# Altium project BugBuster.PrjPcb (part 3 of 4)

## Sheet Analog.SchDoc
size A3; SheetNumber: 4; SheetTotal: 5
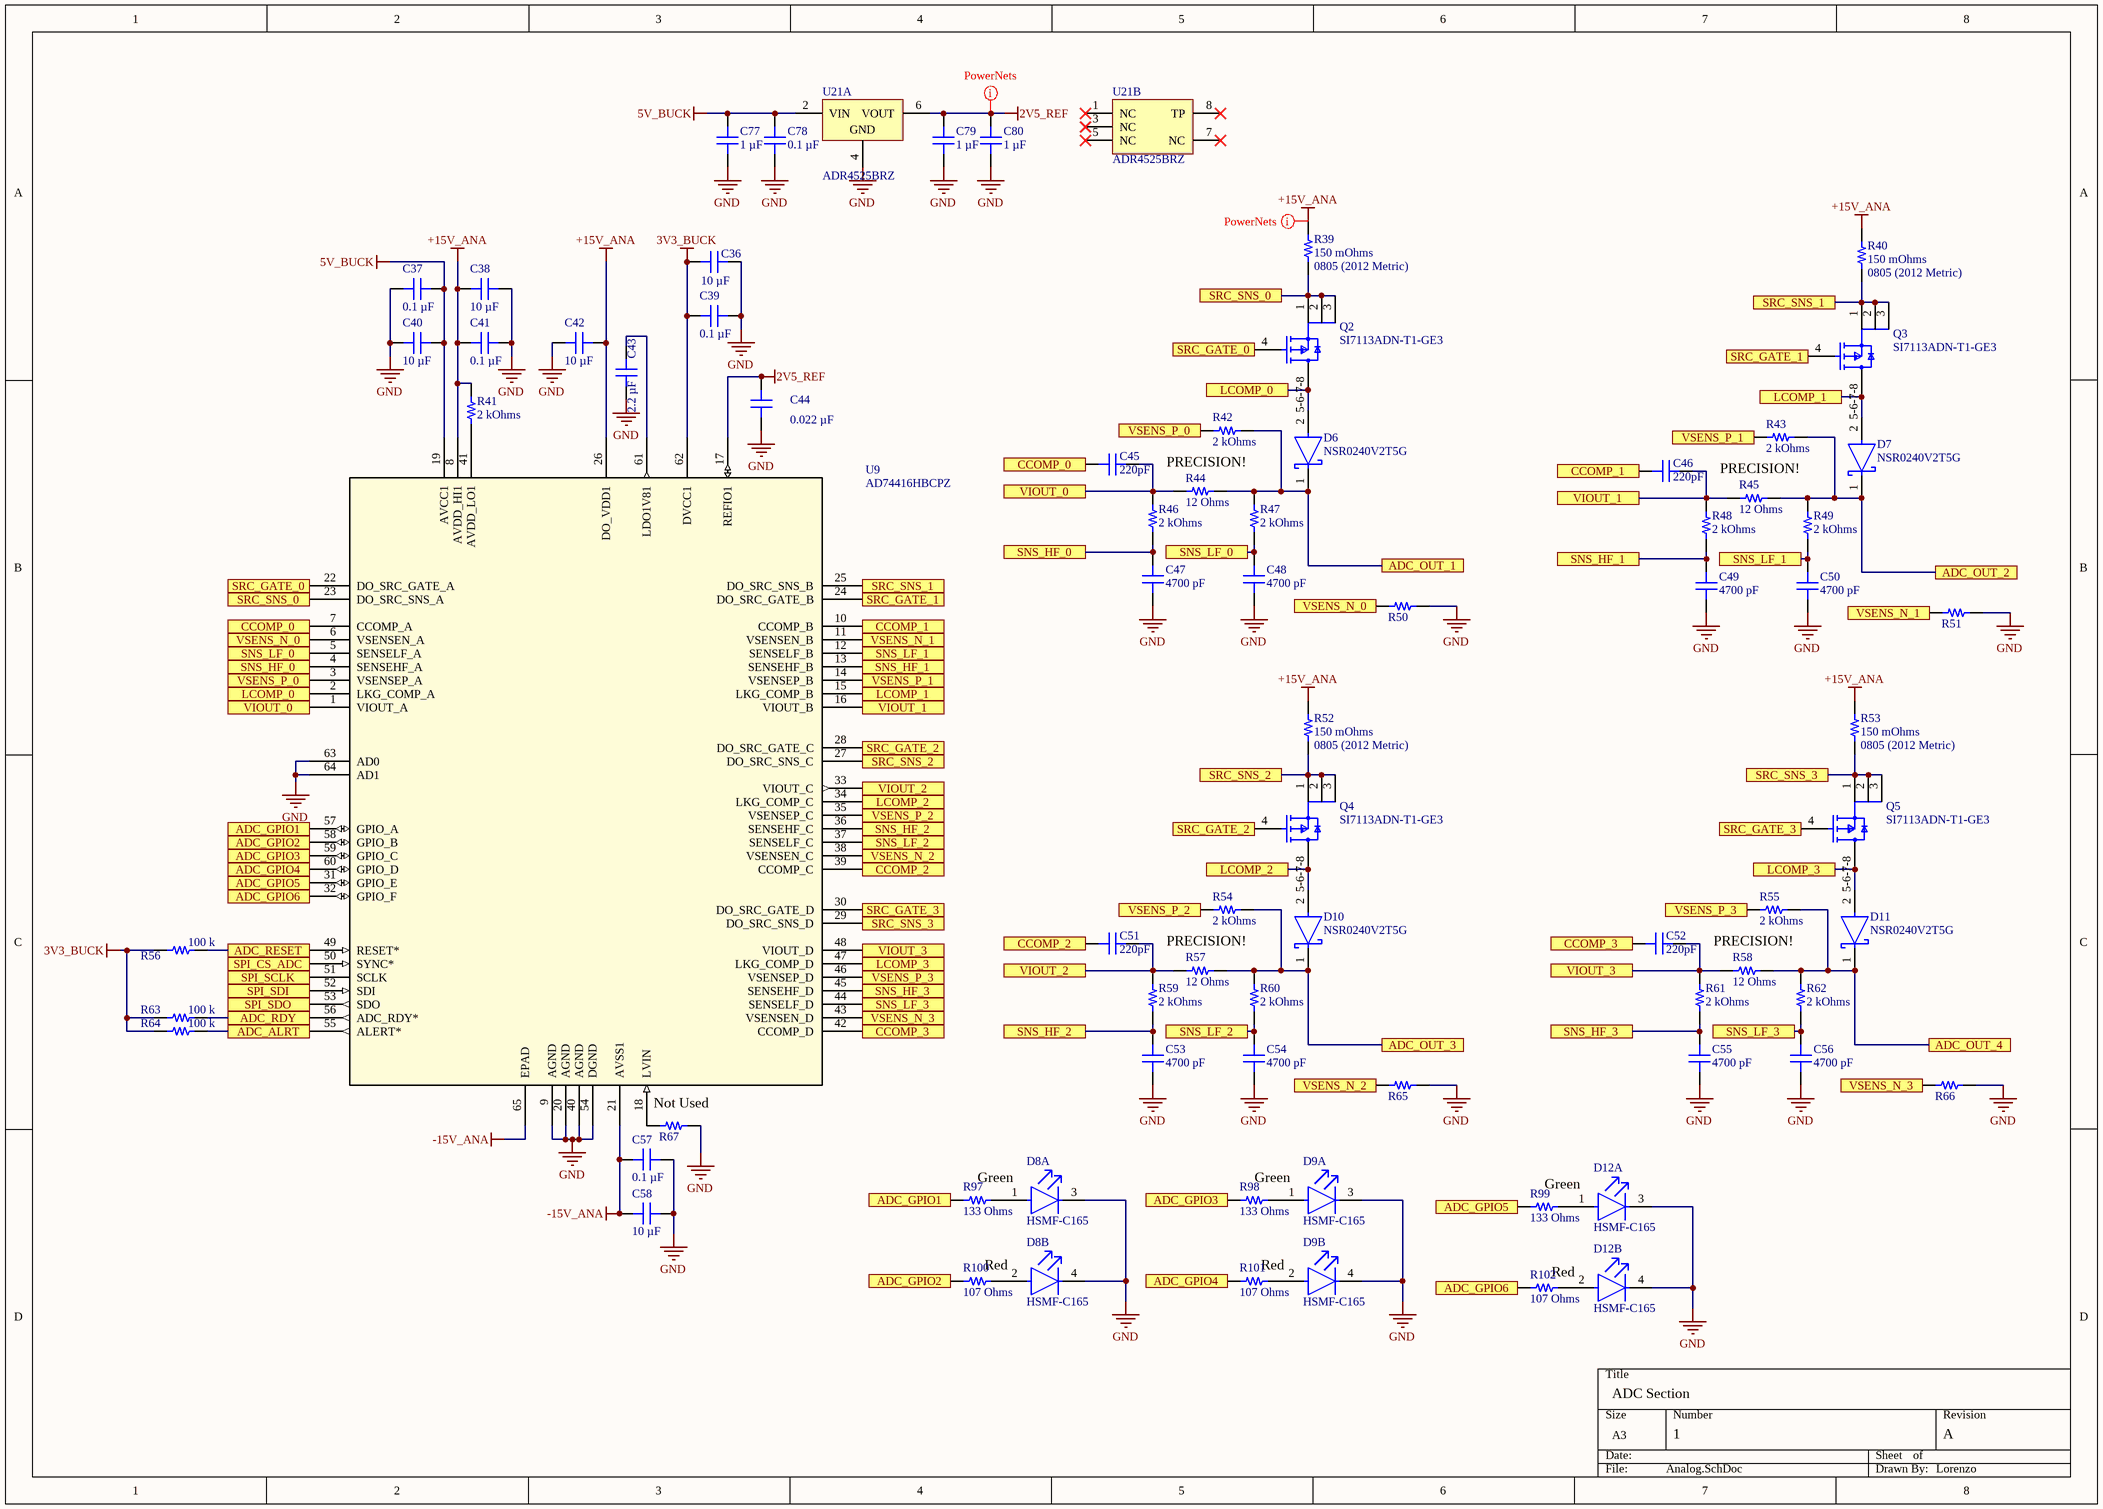
[diagram p3: Analog.SchDoc]

### Parts
C36  10 µF  [CAP 0603_1608]
C37  0.1 µF  [CAP 0603_1608]
C38  10 µF  [CAP 0603_1608]
C39  0.1 µF  [CAP 0603_1608]
C40  10 µF  [CAP 0603_1608]
C41  0.1 µF  [CAP 0603_1608]
C42  10 µF  [CAP 0603_1608]
C43  2.2 µF  [CAP 0603_1608]
C44  0.022 µF  [CAP 0603_1608]
C45  220pF  [CAP 0603_1608]
C46  220pF  [CAP 0603_1608]
C47  4700 pF  [CAP 0603_1608]
C48  4700 pF  [CAP 0603_1608]
C49  4700 pF  [CAP 0603_1608]
C50  4700 pF  [CAP 0603_1608]
C51  220pF  [CAP 0603_1608]
C52  220pF  [CAP 0603_1608]
C53  4700 pF  [CAP 0603_1608]
C54  4700 pF  [CAP 0603_1608]
C55  4700 pF  [CAP 0603_1608]
C56  4700 pF  [CAP 0603_1608]
C57  0.1 µF  [CAP 0603_1608]
C58  10 µF  [CAP 0603_1608]
C77  1 µF  [CAP 0603_1608]
C78  0.1 µF  [CAP 0603_1608]
C79  1 µF  [CAP 0603_1608]
C80  1 µF  [CAP 0603_1608]
D6  NSR0240V2T5G  [FP-502-MFG]
D7  NSR0240V2T5G  [FP-502-MFG]
D8  HSMF-C165  [FP-HSMF-C165-MFG]  (parts A,B of 2)
D9  HSMF-C165  [FP-HSMF-C165-MFG]  (parts A,B of 2)
D10  NSR0240V2T5G  [FP-502-MFG]
D11  NSR0240V2T5G  [FP-502-MFG]
D12  HSMF-C165  [FP-HSMF-C165-MFG]  (parts A,B of 2)
Q2  SI7113ADN-T1-GE3  [FP-S16-2667-SINGLE-MFG]
Q3  SI7113ADN-T1-GE3  [FP-S16-2667-SINGLE-MFG]
Q4  SI7113ADN-T1-GE3  [FP-S16-2667-SINGLE-MFG]
Q5  SI7113ADN-T1-GE3  [FP-S16-2667-SINGLE-MFG]
R39  150 mOhms  Package / Case: 0805 (2012 Metric)  [STACKPOLE CSR0805]
R40  150 mOhms  Package / Case: 0805 (2012 Metric)  [STACKPOLE CSR0805]
R41  2 kOhms  [RES 0603_1608]
R42  2 kOhms  [RES 0603_1608]
R43  2 kOhms  [RES 0603_1608]
R44  12 Ohms  [RES 0603_1608]
R45  12 Ohms  [RES 0603_1608]
R46  2 kOhms  [RES 0603_1608]
R47  2 kOhms  [RES 0603_1608]
R48  2 kOhms  [RES 0603_1608]
R49  2 kOhms  [RES 0603_1608]
R50  (no value)  [RES 0603_1608]
R51  (no value)  [RES 0603_1608]
R52  150 mOhms  Package / Case: 0805 (2012 Metric)  [STACKPOLE CSR0805]
R53  150 mOhms  Package / Case: 0805 (2012 Metric)  [STACKPOLE CSR0805]
R54  2 kOhms  [RES 0603_1608]
R55  2 kOhms  [RES 0603_1608]
R56  100 k  [RES 0603_1608]
R57  12 Ohms  [RES 0603_1608]
R58  12 Ohms  [RES 0603_1608]
R59  2 kOhms  [RES 0603_1608]
R60  2 kOhms  [RES 0603_1608]
R61  2 kOhms  [RES 0603_1608]
R62  2 kOhms  [RES 0603_1608]
R63  100 k  [RES 0603_1608]
R64  100 k  [RES 0603_1608]
R65  (no value)  [RES 0603_1608]
R66  (no value)  [RES 0603_1608]
R67  (no value)  [RES 0603_1608]
R97  133 Ohms  [RES 0603_1608]
R98  133 Ohms  [RES 0603_1608]
R99  133 Ohms  [RES 0603_1608]
R100  107 Ohms  [RES 0603_1608]
R101  107 Ohms  [RES 0603_1608]
R102  107 Ohms  [RES 0603_1608]
U9  AD74416HBCPZ  [CP-64-15_ADI]
U21  ADR4525BRZ  [ADI-R-8_N]  (parts A,B of 2)

### Ports
ADC_ALRT, ADC_GPIO1, ADC_GPIO2, ADC_GPIO3, ADC_GPIO4, ADC_GPIO5, ADC_GPIO6, ADC_OUT_1, ADC_OUT_2, ADC_OUT_3, ADC_OUT_4, ADC_RDY, ADC_RESET, CCOMP_0, CCOMP_1, CCOMP_2, CCOMP_3, LCOMP_0, LCOMP_1, LCOMP_2, LCOMP_3, SNS_HF_0, SNS_HF_1, SNS_HF_2, SNS_HF_3, SNS_LF_0, SNS_LF_1, SNS_LF_2, SNS_LF_3, SPI_CS_ADC, SPI_SCLK, SPI_SDI, SPI_SDO, SRC_GATE_0, SRC_GATE_1, SRC_GATE_2, SRC_GATE_3, SRC_SNS_0, SRC_SNS_1, SRC_SNS_2, SRC_SNS_3, VIOUT_0, VIOUT_1, VIOUT_2, VIOUT_3, VSENS_N_0, VSENS_N_1, VSENS_N_2, VSENS_N_3, VSENS_P_0, VSENS_P_1, VSENS_P_2, VSENS_P_3

### Nets
2V5_REF: C44.2 C79.2 C80.2 U9.17(REFIO1) U21.6(VOUT)
3V3_BUCK: C36.1 C39.1 R56.1 R63.1 R64.1 U9.62(DVCC1)
5V_BUCK: C37.1 C40.1 C77.2 C78.2 U9.19(AVCC1) U21.2(VIN)
+15V_ANA: C38.1 C41.1 C42.2 R39.2 R40.2 R41.2 R52.2 R53.2 U9.8(AVDD_HI1) U9.26(DO_VDD1)
-15V_ANA: C57.2 C58.2 U9.21(AVSS1) U9.65(EPAD)
GND: C36.2 C37.2 C38.2 C39.2 C40.2 C41.2 C42.1 C43.2 C44.1 C47.2 C48.2 C49.2 C50.2 C53.2 C54.2 C55.2 C56.2 C57.1 C58.1 C77.1 C78.1 C79.1 C80.1 D8.3(GREEN_C) D8.4(RED_C) D9.3(GREEN_C) D9.4(RED_C) D12.3(GREEN_C) D12.4(RED_C) R50.2 R51.2 R65.2 R66.2 R67.2 U9.9(AGND) U9.20(AGND) U9.40(AGND) U9.54(DGND) U9.63(AD0) U9.64(AD1) U21.4(GND)
NetC43_1: C43.1 U9.61(LDO1V81)
NetC45_1: C45.1 U9.7(CCOMP_A) ; port CCOMP_0
NetC45_2: C45.2 R44.1 R46.2 U9.1(VIOUT_A) ; port VIOUT_0
NetC46_1: C46.1 U9.10(CCOMP_B) ; port CCOMP_1
NetC46_2: C46.2 R45.1 R48.2 U9.16(VIOUT_B) ; port VIOUT_1
NetC47_1: C47.1 R46.1 U9.4(SENSEHF_A) ; port SNS_HF_0
NetC48_1: C48.1 R47.1 U9.5(SENSELF_A) ; port SNS_LF_0
NetC49_1: C49.1 R48.1 U9.13(SENSEHF_B) ; port SNS_HF_1
NetC50_1: C50.1 R49.1 U9.12(SENSELF_B) ; port SNS_LF_1
NetC51_1: C51.1 U9.39(CCOMP_C) ; port CCOMP_2
NetC51_2: C51.2 R57.1 R59.2 U9.33(VIOUT_C) ; port VIOUT_2
NetC52_1: C52.1 U9.42(CCOMP_D) ; port CCOMP_3
NetC52_2: C52.2 R58.1 R61.2 U9.48(VIOUT_D) ; port VIOUT_3
NetC53_1: C53.1 R59.1 U9.36(SENSEHF_C) ; port SNS_HF_2
NetC54_1: C54.1 R60.1 U9.37(SENSELF_C) ; port SNS_LF_2
NetC55_1: C55.1 R61.1 U9.45(SENSEHF_D) ; port SNS_HF_3
NetC56_1: C56.1 R62.1 U9.44(SENSELF_D) ; port SNS_LF_3
NetD6_1: D6.1(C) R42.2 R44.2 R47.2 ; port ADC_OUT_1
NetD6_2: D6.2(A) Q2.5-6-7-8(D) U9.2(LKG_COMP_A) ; port LCOMP_0
NetD7_1: D7.1(C) R43.2 R45.2 R49.2 ; port ADC_OUT_2
NetD7_2: D7.2(A) Q3.5-6-7-8(D) U9.15(LKG_COMP_B) ; port LCOMP_1
NetD8_1: D8.1(GREEN_A) R97.2
NetD8_2: D8.2(RED_A) R100.2
NetD9_1: D9.1(GREEN_A) R98.2
NetD9_2: D9.2(RED_A) R101.2
NetD10_1: D10.1(C) R54.2 R57.2 R60.2 ; port ADC_OUT_3
NetD10_2: D10.2(A) Q4.5-6-7-8(D) U9.34(LKG_COMP_C) ; port LCOMP_2
NetD11_1: D11.1(C) R55.2 R58.2 R62.2 ; port ADC_OUT_4
NetD11_2: D11.2(A) Q5.5-6-7-8(D) U9.47(LKG_COMP_D) ; port LCOMP_3
NetD12_1: D12.1(GREEN_A) R99.2
NetD12_2: D12.2(RED_A) R102.2
NetQ2_1: Q2.1(S) Q2.2(S) Q2.3(S) R39.1 U9.23(DO_SRC_SNS_A) ; port SRC_SNS_0
NetQ2_4: Q2.4(G) U9.22(DO_SRC_GATE_A) ; port SRC_GATE_0
NetQ3_1: Q3.1(S) Q3.2(S) Q3.3(S) R40.1 U9.25(DO_SRC_SNS_B) ; port SRC_SNS_1
NetQ3_4: Q3.4(G) U9.24(DO_SRC_GATE_B) ; port SRC_GATE_1
NetQ4_1: Q4.1(S) Q4.2(S) Q4.3(S) R52.1 U9.27(DO_SRC_SNS_C) ; port SRC_SNS_2
NetQ4_4: Q4.4(G) U9.28(DO_SRC_GATE_C) ; port SRC_GATE_2
NetQ5_1: Q5.1(S) Q5.2(S) Q5.3(S) R53.1 U9.29(DO_SRC_SNS_D) ; port SRC_SNS_3
NetQ5_4: Q5.4(G) U9.30(DO_SRC_GATE_D) ; port SRC_GATE_3
NetR41_1: R41.1 U9.41(AVDD_LO1)
NetR42_1: R42.1 U9.3(VSENSEP_A) ; port VSENS_P_0
NetR43_1: R43.1 U9.14(VSENSEP_B) ; port VSENS_P_1
NetR50_1: R50.1 U9.6(VSENSEN_A) ; port VSENS_N_0
NetR51_1: R51.1 U9.11(VSENSEN_B) ; port VSENS_N_1
NetR54_1: R54.1 U9.35(VSENSEP_C) ; port VSENS_P_2
NetR55_1: R55.1 U9.46(VSENSEP_D) ; port VSENS_P_3
NetR56_2: R56.2 U9.49(RESET*) ; port ADC_RESET
NetR63_2: R63.2 U9.56(ADC_RDY*) ; port ADC_RDY
NetR64_2: R64.2 U9.55(ALERT*) ; port ADC_ALRT
NetR65_1: R65.1 U9.38(VSENSEN_C) ; port VSENS_N_2
NetR66_1: R66.1 U9.43(VSENSEN_D) ; port VSENS_N_3
NetR67_1: R67.1 U9.18(LVIN)
NetR97_1: R97.1 U9.57(GPIO_A) ; port ADC_GPIO1
NetR98_1: R98.1 U9.59(GPIO_C) ; port ADC_GPIO3
NetR99_1: R99.1 U9.31(GPIO_E) ; port ADC_GPIO5
NetR100_1: R100.1 U9.58(GPIO_B) ; port ADC_GPIO2
NetR101_1: R101.1 U9.60(GPIO_D) ; port ADC_GPIO4
NetR102_1: R102.1 U9.32(GPIO_F) ; port ADC_GPIO6
NetU1_9: U9.51(SCLK) ; port SPI_SCLK
NetU1_10: U9.52(SDI) ; port SPI_SDI
NetU1_11: U9.53(SDO) ; port SPI_SDO
NetU1_33: U9.50(SYNC*) ; port SPI_CS_ADC

Not connected (* = marked no-connect by the designer): U21 1(NC)* 3(NC)* 5(NC)* 7(NC)* 8(TP)*

### Layout directives
net class PowerNets: 2V5_REF, +15V_ANA

### Notes on the sheet
- PRECISION!
- Not Used
- Green
- (near R100) Red
- (near R101) Red
- (near R102) Red
- ADC Section
- 1
- A
- Lorenzo

### Library data of the parts
C36 C38 C40 C42 C58 = KGM15CS61E106MT: CAP CER 10UF 25V X6S 0603; manufacturer: KYOCERA AVX; Tolerance: ±20%; Part Number: KGM15CS61E106MT; Value: 10 µF; Applications: General Purpose; Capacitance: 10 µF; componentlink1description: Datasheet; componentlink1url: https://datasheets.kyocera-avx.com/x6s-dielectric.pdf; componentlink2description: DigiKey Link; componentlink2url: https://www.digikey.com/en/products/detail/kyocera-avx/KGM15CS61E106MT/16602925; Device Package: 0603 (1608 Metric); lastupdated: 09/02/2024 20:09:18; Lifecycle Status: Active; Minimum Order: 1; Mounting Type: Surface Mount, MLCC; Operating Temperature: -55°C ~ 105°C; Package / Case: 0603 (1608 Metric); packaging: TapeAndReel; partid: 52144; Part Status: Active; price: 0.06; series: KGM - X6S; Size / Dimension: 0.063" L x 0.031" W (1.60mm x 0.80mm); Supplier 1: DigiKey; Supplier Part Number 1: 478-KGM15CS61E106MTCT-ND; Temperature Coefficient: X6S; Thickness (Max): 0.039" (1.00mm); Voltage - Rated: 25V
C37 C39 C41 C57 C78 = KAM15AR71H104JT: CAP CER 0.1UF 50V X7R 0603; manufacturer: KYOCERA AVX; Tolerance: ±5%; Part Number: KAM15AR71H104JT; Value: 0.1 µF; Applications: Automotive; Capacitance: 0.1 µF; componentlink1description: Datasheet; componentlink1url: https://datasheets.kyocera-avx.com/AutoMLCC.pdf; componentlink2description: DigiKey Link; componentlink2url: https://www.digikey.com/en/products/detail/kyocera-avx/KAM15AR71H104JT/3080614; Device Package: 0603 (1608 Metric); lastupdated: 09/02/2024 20:09:10; Lifecycle Status: Active; Minimum Order: 1; Mounting Type: Surface Mount, MLCC; Operating Temperature: -55°C ~ 125°C; Package / Case: 0603 (1608 Metric); packaging: TapeAndReel; partid: 54247; Part Status: Active; price: 0.10; Ratings: AEC-Q200; series: -; Size / Dimension: 0.063" L x 0.032" W (1.60mm x 0.81mm); Supplier 1: DigiKey; Supplier Part Number 1: 478-KAM15AR71H104JTCT-ND; Temperature Coefficient: X7R; Thickness (Max): 0.035" (0.90mm); Voltage - Rated: 50V
C43 = GRM188Z71E225KE43D: CAP CER 2.2UF 25V X7R 0603; manufacturer: Murata Electronics; Tolerance: ±10%; Part Number: GRM188Z71E225KE43D; Value: 2.2 µF; Applications: General Purpose; Capacitance: 2.2 µF; componentlink1description: Datasheet; componentlink1url: https://search.murata.co.jp/Ceramy/image/img/A01X/G101/ENG/GRM188Z71E225KE43-01A.pdf; componentlink2description: DigiKey Link; componentlink2url: https://www.digikey.com/en/products/detail/murata-electronics/GRM188Z71E225KE43D/16602147; Device Package: 0603 (1608 Metric); lastupdated: 09/02/2024 20:09:39; Lifecycle Status: Active; Minimum Order: 1; Mounting Type: Surface Mount, MLCC; Operating Temperature: -55°C ~ 125°C; Package / Case: 0603 (1608 Metric); packaging: TapeAndReel; partid: 49829; Part Status: Active; price: 0.02; series: GRM; Size / Dimension: 0.063" L x 0.031" W (1.60mm x 0.80mm); Supplier 1: DigiKey; Supplier Part Number 1: 490-GRM188Z71E225KE43DCT-ND; Temperature Coefficient: X7R; Thickness (Max): 0.039" (1.00mm); Voltage - Rated: 25V
C44 = C0603C223J3RAC7867: CAP CER 0.022UF 25V X7R 0603; manufacturer: KEMET; Tolerance: ±5%; Part Number: C0603C223J3RAC7867; Value: 0.022 µF; Applications: Bypass, Decoupling; Capacitance: 0.022 µF; componentlink1description: Datasheet; componentlink1url: https://api.kemet.com/component-edge/download/datasheet/C0603C223J3RACTU.pdf; componentlink2description: DigiKey Link; componentlink2url: https://www.digikey.com/en/products/detail/kemet/C0603C223J3RAC7867/2200271; Device Package: 0603 (1608 Metric); lastupdated: 09/02/2024 20:09:57; Lifecycle Status: Active; Minimum Order: 1; Mounting Type: Surface Mount, MLCC; Operating Temperature: -55°C ~ 125°C; Package / Case: 0603 (1608 Metric); packaging: TapeAndReel; partid: 35317; Part Status: Active; price: 0.01; series: SMD Comm X7R; Size / Dimension: 0.063" L x 0.031" W (1.60mm x 0.80mm); Supplier 1: DigiKey; Supplier Part Number 1: 399-C0603C223J3RAC7867CT-ND; Temperature Coefficient: X7R; Thickness (Max): 0.034" (0.87mm); Voltage - Rated: 25V
C45 C46 C51 C52 = LD035A221FAB2A: CAP CER 220PF 50V C0G/NP0 0603; manufacturer: AVX Corporation; Temperature Coefficient: C0G, NP0; Tolerance: ±1%; Part Number: LD035A221FAB2A; Value: 220pF; Applications: General Purpose; Capacitance: 220pF; componentlink1description: Datasheet; componentlink1url: http://datasheets.avx.com/LD-Series.pdf; componentlink2description: DigiKey Link; componentlink2url: http://digikey.com/product-detail/en/avx-corporation/LD035A221FAB2A/478-12916-1-ND/9949286; Device Package: 0603 (1608 Metric); lastupdated: 02/09/2020 01:03:21; Lifecycle Status: Active; Minimum Order: 1; Mounting Type: Surface Mount, MLCC; Operating Temperature: -55°C ~ 125°C; Package / Case: 0603 (1608 Metric); packaging: TapeAndReel; partid: 10391; Part Status: Active; price: 0.20; series: LD; Size / Dimension: 0.063" L x 0.032" W (1.60mm x 0.81mm); Supplier 1: DigiKey; Supplier Part Number 1: 478-12916-1-ND; Thickness (Max): 0.035" (0.90mm); Voltage - Rated: 50V
C47-C50 C53-C56 = C0603X472K5RAC3316: CAP CER 4700PF 50V X7R 0603; manufacturer: KEMET; Tolerance: ±10%; Part Number: C0603X472K5RAC3316; Value: 4700 pF; Applications: Automotive, Boardflex Sensitive; Capacitance: 4700 pF; componentlink1description: Datasheet; componentlink1url: https://connect.kemet.com:7667/gateway/IntelliData-ComponentDocumentation/1.0/download/datasheet/C0603X472K5RAC3316; componentlink2description: DigiKey Link; componentlink2url: https://www.digikey.com/en/products/detail/kemet/C0603X472K5RAC3316/12082514; Device Package: 0603 (1608 Metric); Features: Soft Termination; lastupdated: 09/02/2024 20:09:41; Lifecycle Status: Active; Minimum Order: 1; Mounting Type: Surface Mount, MLCC; Operating Temperature: -55°C ~ 125°C; Package / Case: 0603 (1608 Metric); packaging: TapeAndReel; partid: 48440; Part Status: Active; price: 0.06; Ratings: AEC-Q200; series: SMD Auto X7R VW80808; Size / Dimension: 0.063" L x 0.031" W (1.60mm x 0.80mm); Supplier 1: DigiKey; Supplier Part Number 1: 399-C0603X472K5RAC3316CT-ND; Temperature Coefficient: X7R; Thickness (Max): 0.037" (0.95mm); Voltage - Rated: 50V
C77 C79 C80 = C1608X5R1H105K080AB: CAP CER 1UF 50V X5R 0603; manufacturer: TDK Corporation; Tolerance: ±10%; Part Number: C1608X5R1H105K080AB; Value: 1 µF; Applications: General Purpose; Capacitance: 1 µF; componentlink1description: Datasheet; componentlink1url: https://product.tdk.com/info/en/catalog/datasheets/mlcc_commercial_general_en.pdf?ref_disty=digikey; componentlink2description: DigiKey Link; componentlink2url: https://www.digikey.com/en/products/detail/tdk-corporation/C1608X5R1H105K080AB/2732903; Device Package: 0603 (1608 Metric); Features: Low ESL; lastupdated: 09/02/2024 20:10:02; Lifecycle Status: Active; Minimum Order: 1; Mounting Type: Surface Mount, MLCC; Operating Temperature: -55°C ~ 85°C; Package / Case: 0603 (1608 Metric); packaging: TapeAndReel; partid: 36337; Part Status: Active; price: 0.02; series: C; Size / Dimension: 0.063" L x 0.031" W (1.60mm x 0.80mm); Supplier 1: DigiKey; Supplier Part Number 1: 445-7468-1-ND; Temperature Coefficient: X5R; Thickness (Max): 0.035" (0.90mm); Voltage - Rated: 50V
D6 D7 D10 D11 = CMP-00278-24638172-1: NSR0240V2T5G Diode Schottky 40V 0.25A 2-Pin SOD-523 T/R; Manufacturer Lifecycle Status: ACTIVE; Peak Non-Repetitive Surge Current: 1A; Peak Reverse Current: 500nA; Element Configuration: Single; Reverse Recovery Time: 3ns; Forward Current: 250mA; Max Forward Surge Current (Ifsm): 2A; Capacitance: 4pF; Max Junction Temperature (Tj): 150°C; RoHS: Compliant; Radiation Hardening: No; Reverse Voltage: 40V; Max Reverse Voltage (DC): 40V; Height: 700µm; Max Repetitive Reverse Voltage (Vrrm): 40V; Number of Pins: 2; Lifecycle Status: Production; NexarPartId: 24638172; Max Operating Temperature: 150°C; Lead Free: Lead Free; Mount: Surface Mount; Average Rectified Current: 250mA; Min Operating Temperature: -55°C; Packaging: Tape & Reel
D8 D9 D12 = CMP-2000-06424-2: LED GREEN/RED DIFFUSED 0603 SMD; Reverse Voltage: 5V; Dominant Wavelength: 621nm; Number of Elements: 2; Shape: Rectangular; Luminous Intensity: 10mcd; Forward Current: 20mA; Lens Color: White; Illumination Color: Green; Power Dissipation: 52mW; Wavelength: 572nm; Viewing Angle: 120°; Forward Voltage: 2.2V; Max Operating Temperature: 85°C; Lens Transparency: Diffused; Width: 0.8mm; Case/Package: 0603; Packaging: Tape and Reel; Case Code (Metric): 1608; Depth: 0.8mm; REACH SVHC: No SVHC; Number of LEDs: 2; Radiation Hardening: No; Lens Style: Rectangular; Color: Green; Case Code (Imperial): 0603; Min Operating Temperature: -40°C; Power Rating: 52mW; Number of Pins: 4; Number of Terminals: 4; Package Quantity: 1; Mount: Surface Mount; Height: 0.5mm; Length: 1.6mm; Lead Free: Lead Free; Test Current: 20mA
Q2-Q5 = CMP-02550-000064-1: MOSFET P-CH 100V 10.8A 1212-8; Manufacturer: Vishay; Pulse Drain Current: -20A; Reverse Recovery Charge: 80nC; Standoff Height: 0mm; Max Junction Temp: +150°C; Max Forward Diode Voltage: -1.2V; Depletion Mode: False; Turn Off Delay Time: 20ns; Drain To Source Resistance: 0.11Ω; Turn On Delay Time: 10ns; Rthja Max: 36°C/W; Gate Charge At Vgs: 10.9nC @ -10V; Transconductance: 8S; Typ Forward Diode Voltage: -0.8V; Threshold Vgs Max: -2.6V; Drain To Source Voltage: -100V; Power Dissipation: 3.5W; Threshold Vgs Min: -1.1V; Input Capacitace At Vds: 515pF @ -50V; Continuous Drain Current: -3.8A; Number Of P Channels: 1; Reverse Recovery Time: 43ns; Gate To Source Voltage: 20V; Automotive: No; Lead Free: Yes; Temperature Range Low: -55°C; Device Class L1: Discrete Semiconductors; Temperature: -55°C to +150°C; ComponentLink2URL: http://www.vishay.com/docs/77678/si7113adn.pdf; Device Class L3: MOSFETs; Device Class L2: Transistors; Footprint Url: https://www.vishay.com/docs/72597/72597.pdf; Digikey Description: MOSFET P-CH 100V 10.8A 1212-8; RoHS: TRUE; Height: 1.17mm; Package: S16-2667-SINGLE; Octopart: https://octopart.com/si7113adn-t1-ge3-vishay-88182558; ComponentLink2Description: Datasheet; Temperature Range High: +150°C; Manufacturer Part Number: SI7113ADN-T1-GE3; Category: Trans; Drain To Source Breakdown Voltage: -100V; Number Of Channels: 1
R39 R40 R52 R53 = KDV08DR150ET: RES 0.15 OHM 0.5% 1/4W 0805; Manufacturer: Ohmite; Power (Watts): 0.25W, 1/4W; Temperature Coefficient: ±50ppm/°C; Part Number: KDV08DR150ET; ComponentLink1Description: Datasheet; ComponentLink1URL: https://www.ohmite.com/assets/docs/res_kdv.pdf?r=false; ComponentLink2Description: DigiKey Link; ComponentLink2URL: https://www.digikey.com/en/products/detail/ohmite/KDV08DR150ET/10476573; Composition: Metal Film; Device Package: 0805 (2012 Metric); Features: Current Sense; Height - Seated (Max): 0.026" (0.65mm); LastUpdated: 03/06/2024 19:48:49; Lifecycle Status: Active; Minimum Order: 1; Number of Terminations: 2; Operating Temperature: -55°C ~ 155°C; Packaging: TapeAndReel; PartId: 3876; Part Status: Active; Price: 0.03; Resistance: 150 mOhms; Series: KDV; Size / Dimension: 0.079" L x 0.049" W (2.00mm x 1.25mm); Supplier 1: DigiKey; Supplier Part Number 1: 273-KDV08DR150ETCT-ND; Supplier Device Package: 0805; Tolerance: ±0.5%; Value: 150 mOhms
R41 = AC0603FR-132KL: RES 2K OHM 1% 1/10W 0603; Manufacturer: Yageo; Power (Watts): 0.1W, 1/10W; Temperature Coefficient: ±100ppm/°C; Part Number: AC0603FR-132KL; Value: 2 kOhms; ComponentLink1Description: Datasheet; ComponentLink1URL: https://www.yageo.com/upload/media/product/productsearch/datasheet/rchip/PYu-AC_51_RoHS_L_10.pdf; ComponentLink2Description: DigiKey Link; ComponentLink2URL: https://www.digikey.com/en/products/detail/yageo/AC0603FR-132KL/17011825; Composition: Thick Film; Device Package: 0603 (1608 Metric); Features: Automotive AEC-Q200, Moisture Resistant; Height - Seated (Max): 0.022" (0.55mm); LastUpdated: 09/02/2024 20:40:30; Lifecycle Status: Active; Minimum Order: 1; Number of Terminations: 2; Operating Temperature: -55°C ~ 155°C; Package / Case: 0603 (1608 Metric); Packaging: CutTape; PartId: 83869; Price: 0.01; Ratings: AEC-Q200; Resistance: 2 kOhms; Series: AC; Size / Dimension: 0.063" L x 0.031" W (1.60mm x 0.80mm); Supplier 1: DigiKey; Supplier Part Number 1: 13-AC0603FR-132KLCT-ND; Supplier Device Package: 0603; Tolerance: ±1%
R42 R43 R46-R49 R54 R55 R59-R62 = ERJ-S03F2001V: RES SMD 2K OHM 1% 1/10W 0603; Manufacturer: Panasonic Electronic Components; Power (Watts): 0.1W, 1/10W; Temperature Coefficient: ±100ppm/°C; Part Number: ERJ-S03F2001V; Value: 2 kOhms; ComponentLink1Description: Datasheet; ComponentLink1URL: https://industrial.panasonic.com/ww/products/pt/anti-sulfurated-chip-resistors/models/ERJS03F2001V; ComponentLink2Description: DigiKey Link; ComponentLink2URL: https://www.digikey.com/en/products/detail/panasonic-electronic-components/ERJ-S03F2001V/1162048; Composition: Thick Film; Device Package: 0603 (1608 Metric); Features: Anti-Sulfur, Automotive AEC-Q200; Height - Seated (Max): 0.022" (0.55mm); LastUpdated: 09/02/2024 20:40:33; Lifecycle Status: Active; Minimum Order: 1; Number of Terminations: 2; Operating Temperature: -55°C ~ 155°C; Package / Case: 0603 (1608 Metric); Packaging: TapeAndReel; PartId: 82187; Price: 0.02; Ratings: AEC-Q200; Resistance: 2 kOhms; Series: ERJ-S03; Size / Dimension: 0.063" L x 0.031" W (1.60mm x 0.80mm); Supplier 1: DigiKey; Supplier Part Number 1: 10-ERJ-S03F2001VCT-ND; Supplier Device Package: 0603; Tolerance: ±1%
R44 R45 R57 R58 = RT0603BRD0712RL: RES SMD 12 OHM 0.1% 1/10W 0603; Manufacturer: Yageo; Power (Watts): 0.1W, 1/10W; Temperature Coefficient: ±25ppm/°C; Part Number: RT0603BRD0712RL; Value: 12 Ohms; ComponentLink1Description: Datasheet; ComponentLink1URL: https://www.yageo.com/upload/media/product/productsearch/datasheet/rchip/PYu-RT_1-to-0.01_RoHS_L_12.pdf; ComponentLink2Description: DigiKey Link; ComponentLink2URL: https://www.digikey.com/en/products/detail/yageo/RT0603BRD0712RL/1072233; Composition: Thin Film; Device Package: 0603 (1608 Metric); Height - Seated (Max): 0.022" (0.55mm); LastUpdated: 09/02/2024 20:41:27; Lifecycle Status: Active; Minimum Order: 1; Number of Terminations: 2; Operating Temperature: -55°C ~ 155°C; Package / Case: 0603 (1608 Metric); Packaging: TapeAndReel; PartId: 63018; Part Status: Active; Price: 0.03; Resistance: 12 Ohms; Series: RT; Size / Dimension: 0.063" L x 0.031" W (1.60mm x 0.80mm); Supplier 1: DigiKey; Supplier Part Number 1: 13-RT0603BRD0712RLCT-ND; Supplier Device Package: 0603; Tolerance: ±0.1%
R50 R51 R65-R67 = MCT0603MZ0000ZP500: RES 0 OHM JUMPER 1/8W 0603; Manufacturer: Vishay Beyschlag; Power (Watts): 0.125W, 1/8W; Part Number: MCT0603MZ0000ZP500; ComponentLink1Description: Datasheet; ComponentLink1URL: http://www.vishay.com/docs/28760/mcat_pro.pdf; ComponentLink2Description: DigiKey Link; ComponentLink2URL: http://digikey.com/product-detail/en/vishay-beyschlag/MCT0603MZ0000ZP500/749-1745-1-ND/7348053; Composition: Thin Film; Device Package: 0603 (1608 Metric); Features: Anti-Sulfur, Automotive AEC-Q200; Height - Seated (Max): 0.022" (0.55mm); LastUpdated: 14/02/2022 15:05:22; Lifecycle Status: Active; Minimum Order: 1; Number of Terminations: 2; Operating Temperature: -55°C ~ 155°C; Package / Case: 0603 (1608 Metric); Packaging: TapeAndReel; PartId: 10258; Part Status: Active; Price: 0.04; Ratings: AEC-Q200; Series: MCT AT - Professional; Size / Dimension: 0.061" L x 0.033" W (1.55mm x 0.85mm); Supplier 1: DigiKey; Supplier Part Number 1: 749-1745-1-ND; Supplier Device Package: 0603; Tolerance: Jumper
R56 R63 R64 = SG73P1JTTD1003F: RES 100K OHM 1% 1/3W 0603; Manufacturer: KOA Speer Electronics, Inc.; Power (Watts): 0.333W, 1/3W; Resistance: 100 kOhms; Temperature Coefficient: ±100ppm/°C; Part Number: SG73P1JTTD1003F; Value: 100 k; ComponentLink1Description: Datasheet; ComponentLink1URL: https://www.koaspeer.com/pdfs/SG73P.pdf; ComponentLink2Description: DigiKey Link; ComponentLink2URL: https://www.digikey.com/en/products/detail/koa-speer-electronics-inc/SG73P1JTTD1003F/10188341; Composition: Thick Film; Device Package: 0603 (1608 Metric); Features: Automotive AEC-Q200, Pulse Withstanding; Height - Seated (Max): 0.022" (0.55mm); LastUpdated: 09/02/2024 20:40:28; Lifecycle Status: Active; Minimum Order: 1; Number of Terminations: 2; Operating Temperature: -55°C ~ 155°C; Package / Case: 0603 (1608 Metric); Packaging: TapeAndReel; PartId: 83707; Price: 0.01; Ratings: AEC-Q200; Series: SG73P; Size / Dimension: 0.063" L x 0.031" W (1.60mm x 0.80mm); Supplier 1: DigiKey; Supplier Part Number 1: 2019-SG73P1JTTD1003FCT-ND; Supplier Device Package: 0603; Tolerance: ±1%
R97-R99 = CRCW0603133RFKEA: RES SMD 133 OHM 1% 1/10W 0603; Manufacturer: Vishay Dale; Power (Watts): 0.1W, 1/10W; Temperature Coefficient: ±100ppm/°C; Part Number: CRCW0603133RFKEA; Value: 133 Ohms; ComponentLink1Description: Datasheet; ComponentLink1URL: http://www.vishay.com/docs/20035/dcrcwe3.pdf; ComponentLink2Description: DigiKey Link; ComponentLink2URL: https://www.digikey.com/en/products/detail/vishay-dale/CRCW0603133RFKEA/1174567; Composition: Thick Film; Device Package: 0603 (1608 Metric); Features: Automotive AEC-Q200; Height - Seated (Max): 0.020" (0.50mm); LastUpdated: 09/02/2024 20:43:24; Lifecycle Status: Active; Minimum Order: 1; Number of Terminations: 2; Operating Temperature: -55°C ~ 155°C; Package / Case: 0603 (1608 Metric); Packaging: TapeAndReel; PartId: 7931; Part Status: Active; Price: 0.01; Ratings: AEC-Q200; Resistance: 133 Ohms; Series: CRCW; Size / Dimension: 0.061" L x 0.033" W (1.55mm x 0.85mm); Supplier 1: DigiKey; Supplier Part Number 1: 541-133HCT-ND; Supplier Device Package: 0603; Tolerance: ±1%
R100-R102 = CRCW0603107RFKEA: RES SMD 107 OHM 1% 1/10W 0603; Manufacturer: Vishay Dale; Power (Watts): 0.1W, 1/10W; Temperature Coefficient: ±100ppm/°C; Part Number: CRCW0603107RFKEA; Value: 107 Ohms; ComponentLink1Description: Datasheet; ComponentLink1URL: http://www.vishay.com/docs/20035/dcrcwe3.pdf; ComponentLink2Description: DigiKey Link; ComponentLink2URL: https://www.digikey.com/en/products/detail/vishay-dale/CRCW0603107RFKEA/1174557; Composition: Thick Film; Device Package: 0603 (1608 Metric); Features: Automotive AEC-Q200; Height - Seated (Max): 0.020" (0.50mm); LastUpdated: 09/02/2024 20:43:24; Lifecycle Status: Active; Minimum Order: 1; Number of Terminations: 2; Operating Temperature: -55°C ~ 155°C; Package / Case: 0603 (1608 Metric); Packaging: TapeAndReel; PartId: 7927; Part Status: Active; Price: 0.01; Ratings: AEC-Q200; Resistance: 107 Ohms; Series: CRCW; Size / Dimension: 0.061" L x 0.033" W (1.55mm x 0.85mm); Supplier 1: DigiKey; Supplier Part Number 1: 541-107HCT-ND; Supplier Device Package: 0603; Tolerance: ±1%
U9 = AD74416HBCPZ: Quad-Channel, Software Configurable Input and Output with HART Modem; Manufacturer_Name: Analog Devices Inc; Copyright: Copyright (C) 2025 Ultra Librarian. All rights reserved.; Manufacturer_Part_Number: AD74416HBCPZ; RefDes: RefDes; Type: Type
U21 = CMP-0784-00254-1: Ultralow Noise, High Accuracy Voltage Reference, 2.5 V Output, 3 to 15 V Supply, Industrial, 8-pin SOIC (R-8), Tube; Manufacturer: Analog Devices; Vout: 2.5V; Min V Supply (V): 3; Max V Supply (V): 15; Ref Out TC (ppm/C): 2; Code_JEDEC: MS-012-AA; ComponentLink2URL: http://www.analog.com/static/imported-files/data_sheets/ADR4520_4525_4530_4533_4540_4550.pdf; ComponentLink4Description: URL Link1; ComponentLink3Description: Package Specification; Packing: Tube; ComponentLink4URL: Product URL:http://www.analog.com/en/special-linear-functions/voltage-references/adr4525/products/product.html; PackageVersion: 060506-A, 06/2006; Operating Temp Range: -40 to 125 degC; PartNumber: ADR4525BRZ; DatasheetVersion: Rev. 0; PackageReference: R-8; ComponentLink1Description: Manufacturer URL; ComponentLink2Description: Datasheet; PackageDescription: 8-Pin Standard Small Outline Package, Body 4.9 x 3.9 mm, Pitch 1.27 mm; ComponentLink1URL: http://www.analog.com/en/index.html; ComponentLink3URL: http://www.analog.com/static/imported-files/packages/PKG_PDF/SOIC_Narrow%20(R)/R_8.pdf; Mounting Technology: Surface Mount